# EAGLE design illuminator control boardv1-4 (EAGLE 7.6.0)
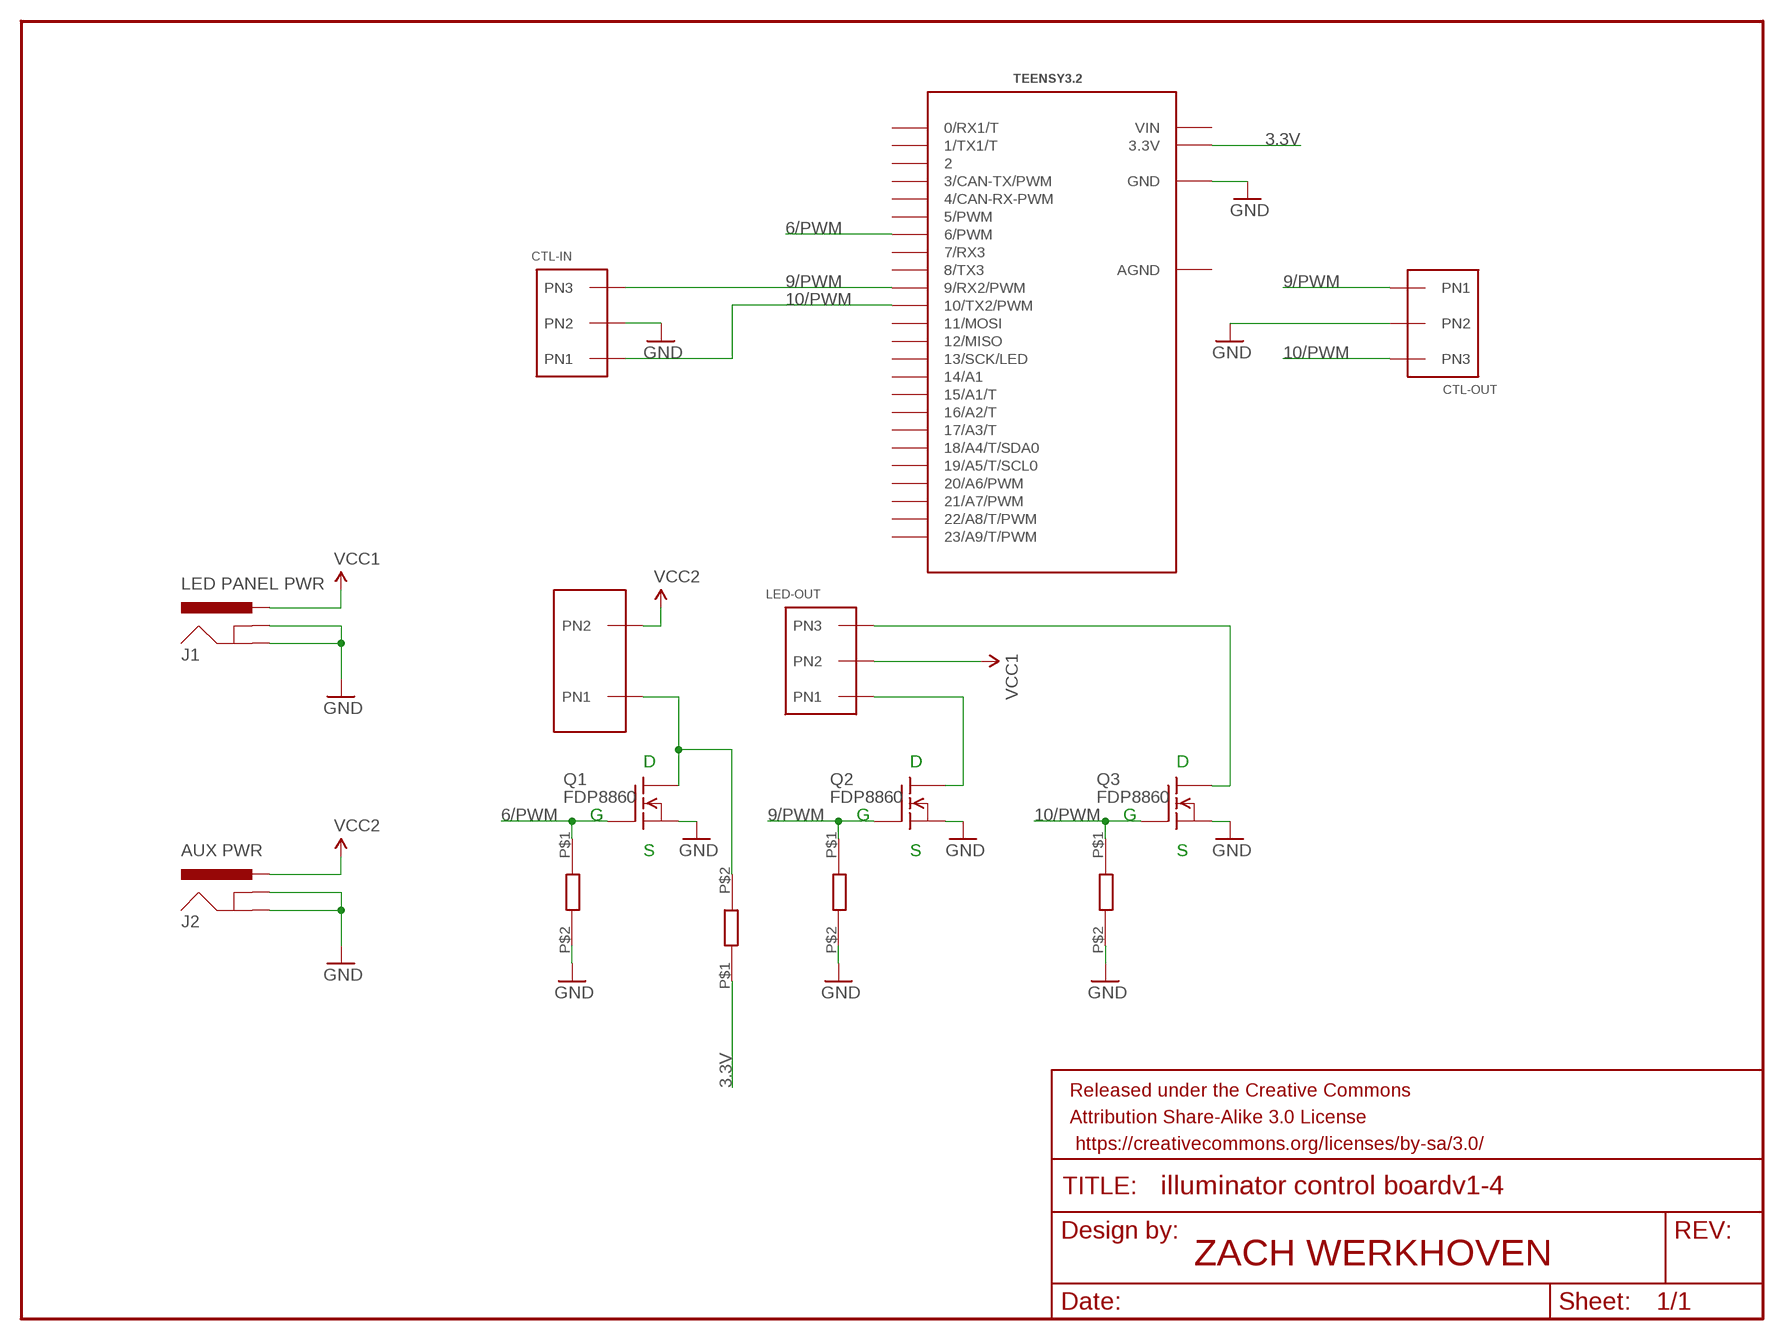
[diagram p0: schematic, sheet 1]

## Parts
AUX-OUT  AUX-OUT  MLX-2PN  [MLX-2PN]
CTL-IN  MLX-3PN  [MLX-3PN]
CTL-OUT  MLX-3PN  [MLX-3PN]
FRAME1  FRAME-LETTER  [CREATIVE_COMMONS]
J1  LED PANEL PWR  POWER_JACKPTH_BREAD  [POWER_JACK_PTH_BREAD]
J2  AUX PWR  POWER_JACKPTH_BREAD  [POWER_JACK_PTH_BREAD]
LED-OUT  MLX-3PN  [MLX-3PN]
Q1  FDP8860  BUZ10  [TO220]
Q2  FDP8860  BUZ10  [TO220]
Q3  FDP8860  BUZ10  [TO220]
TEENSY3.2  TEENSY_3.1_DIL  [TEENSY3-DIL]
U$1  SMD-1206  [SMD-1206]
U$2  SMD-1206  [SMD-1206]
U$3  SMD-1206  [SMD-1206]
U$5  SMD-1206  [SMD-1206]

## Nets
3.3V: TEENSY3.2.3.3V U$5.P$1
6/PWM: Q1.1(G) TEENSY3.2.6(6/PWM) U$1.P$1
9/PWM: CTL-IN.PN3 CTL-OUT.PN1 Q2.1(G) TEENSY3.2.9(9/RX2/PWM) U$2.P$1
10/PWM: CTL-IN.PN1 CTL-OUT.PN3 Q3.1(G) TEENSY3.2.10(10/TX2/PWM) U$3.P$1
GND: CTL-IN.PN2 CTL-OUT.PN2 J1.GND J1.GNDBREAK J2.GND J2.GNDBREAK Q1.3(S) Q2.3(S) Q3.3(S) TEENSY3.2.GND U$1.P$2 U$2.P$2 U$3.P$2
N$1: LED-OUT.PN3 Q3.2(D)
N$2: LED-OUT.PN1 Q2.2(D)
N$3: AUX-OUT.PD1(PN1) Q1.2(D) U$5.P$2
VCC: AUX-OUT.PD2(PN2) J1.PWR J2.PWR LED-OUT.PN2 ; supply symbol labelled VCC1, VCC2
Unconnected: TEENSY3.2.0(0/RX1/T) TEENSY3.2.1(1/TX1/T) TEENSY3.2.2 TEENSY3.2.3(3/CAN-TX/PWM) TEENSY3.2.4(4/CAN-RX-PWM) TEENSY3.2.5(5/PWM) TEENSY3.2.7(7/RX3) TEENSY3.2.8(8/TX3) TEENSY3.2.11(11/MOSI) TEENSY3.2.12(12/MISO) TEENSY3.2.13(13/SCK/LED) TEENSY3.2.14/A0(14/A1) TEENSY3.2.15/A1(15/A1/T) TEENSY3.2.16/A2(16/A2/T) TEENSY3.2.17/A3(17/A3/T) TEENSY3.2.18/A4(18/A4/T/SDA0) TEENSY3.2.19/A5(19/A5/T/SCL0) TEENSY3.2.20/A6(20/A6/PWM) TEENSY3.2.21/A7(21/A7/PWM) TEENSY3.2.22/A8(22/A8/T/PWM) TEENSY3.2.23/A9(23/A9/T/PWM)

## Notes on the sheet
- D | D | D
- G | G | G
- S | S | S
- ZACH WERKHOVEN

## Power pins joined to a net without a drawn wire
AGND: TEENSY3.2.AGND
VIN: TEENSY3.2.VIN

## Library data of the parts
AUX-OUT = Zach-Custom:MLX-2PN
CTL-IN CTL-OUT LED-OUT = Zach-Custom:MLX-3PN: MOLEX 3-PIN RIGHT ANGLE THROUGH HOLE CONNECTOR (MALE) - Digikey PN WM2785-ND Mates with Digikey PN WM2001-ND
FRAME1 = SparkFun-Retired:FRAME-LETTER: Schematic Frame Standard 8.5x11 US Letter frame
J1 J2 = SparkFun-Connectors:POWER_JACK: Power Jack This is the standard 5.5mm barrel jack for power. The PTH is the most common, proven, reliable, footprint. The Slot footprint only works if the mill layer is transmitted to the PCB fab house so be warned. Mating wall wart : TOL-00298 (and others); PROD_ID: PRT-10811
Q1 = Zach-Custom:BUZ10: N-Channel Enhancement MOSFET 50V; 20A; 0,080Ohm
Q2 Q3 = transistor-fet:BUZ10: N-Channel Enhancement MOSFET 50V; 20A; 0,080Ohm
TEENSY3.2 = Teensy_3_and_LC_Series_Boards_v1.1:TEENSY_3.1_DIL: Teensy 3.1 or 3.2 in a DIL Layout.
U$1-U$3 U$5 = Zach-Custom:SMD-1206

## Board
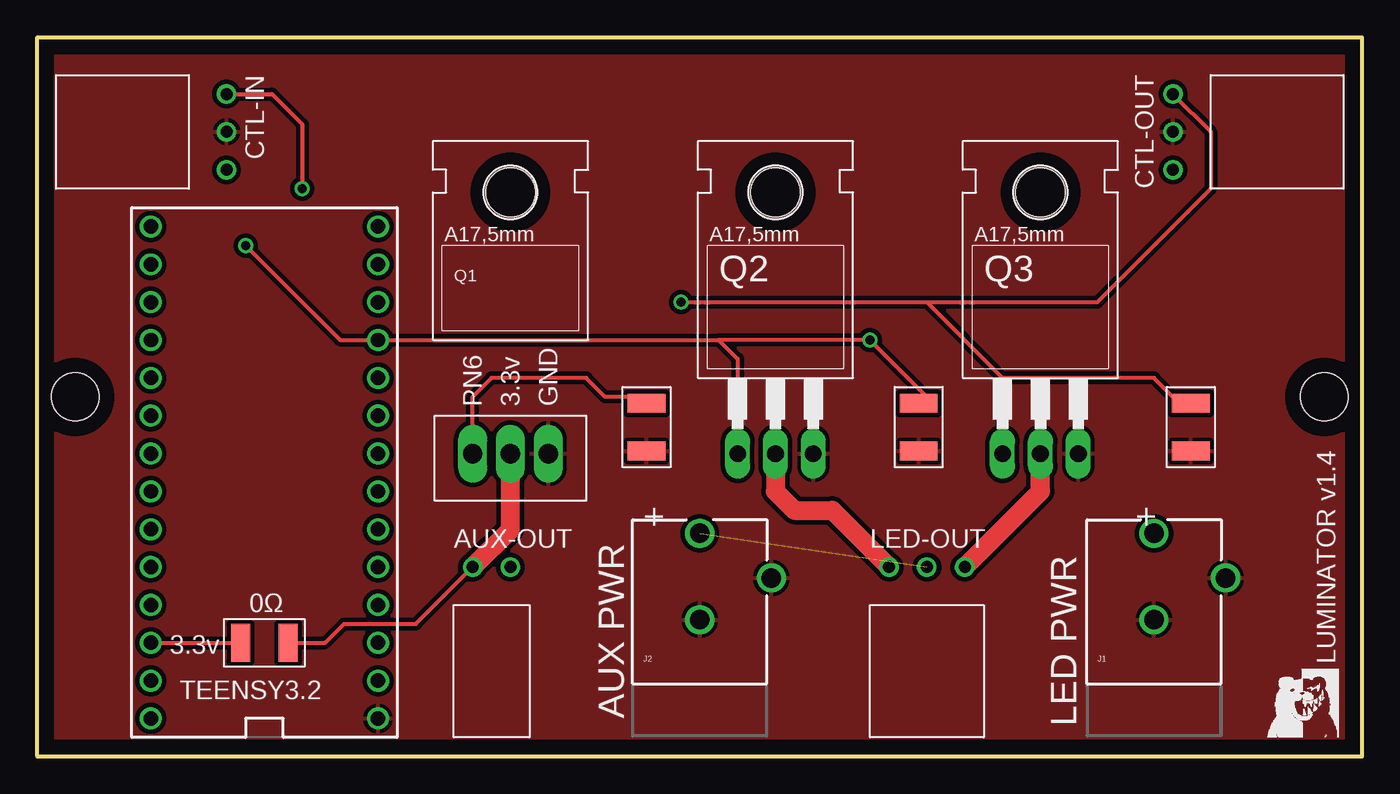
[diagram p1: board, top side]
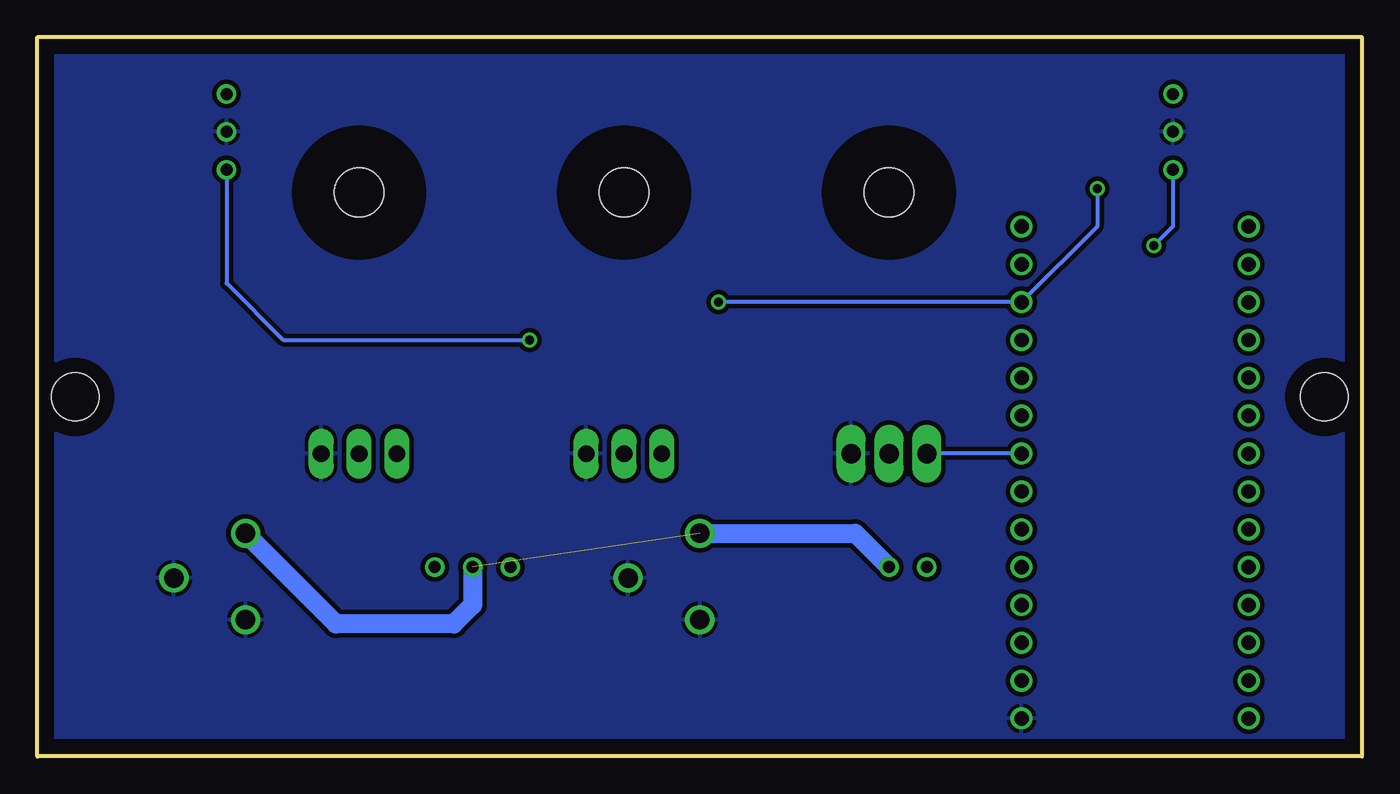
[diagram p2: board, bottom side, seen from below]

Size 88.9 x 48.26 mm. Coordinates in mm from the lower left corner, seen from the top.
Outline: 0,0 0,48.26 88.9,48.26 88.9,0 0,0
Copper layers (1*16): Top 0.035mm / dielectric 1.5mm / Bottom 0.035mm
Design rules "default": minimum track width 10mil, minimum drill 24mil, track to track 8mil, track to pad 8mil, pad to pad 8mil, via to via 8mil, smd to smd 8mil, copper to edge 40mil, drill to drill 8mil, minimum pad ring 10mil, minimum via ring 8mil, stop-mask expansion 4mil, vias tented up to drill 0mil, thermal gap 10mil
Holes 3.2 mm at 2.54,24.13 86.36,24.13

### Footprints (pad centres in the part's own frame; a part is rotated, then mirrored left to right if it is on the bottom)
MLX-2PN = drill 0.8 pad 1.27: PD1 -1.27,6.35; PD2 1.27,6.35
MLX-3PN = drill 0.8 pad 1.27: PN1 -2.54,6.35; PN2 0,6.35; PN3 2.54,6.35
POWER_JACK_PTH_BREAD = drill 1.3: GND 0,7.9; GNDBREAK 4.8,10.7; PWR 0,13.7
TO220 = drill 1.3 pad 1.778 long: 1 -2.54,-6.35; 2 0,-6.35; 3 2.54,-6.35 | hole 3.302: 0,11.176
TO220' = drill 1.118 long: 1 -2.54,-6.35; 2 0,-6.35; 3 2.54,-6.35 | hole 3.302: 0,11.176
TEENSY3-DIL = drill 0.965: 0 -7.62,13.97; 1 -7.62,11.43; 2 -7.62,8.89; 3 -7.62,6.35; 3.3V 7.62,11.43; 4 -7.62,3.81; 5 -7.62,1.27; 6 -7.62,-1.27; 7 -7.62,-3.81; 8 -7.62,-6.35; 9 -7.62,-8.89; 10 -7.62,-11.43; 11 -7.62,-13.97; 12 -7.62,-16.51; 13 7.62,-16.51; 14/A0 7.62,-13.97; 15/A1 7.62,-11.43; 16/A2 7.62,-8.89; 17/A3 7.62,-6.35; 18/A4 7.62,-3.81; 19/A5 7.62,-1.27; 20/A6 7.62,1.27; 21/A7 7.62,3.81; 22/A8 7.62,6.35; 23/A9 7.62,8.89; AGND 7.62,13.97; GND -7.62,16.51; VIN 7.62,16.51
SMD-1206 = smd 2.54 x 1.27: P$1 0,1.6; P$2 0,-1.6

### Placement (x,y rotation side)
AUX-OUT  30.48,6.35 0 top
CTL-IN  6.35,41.91 270 top
CTL-OUT  82.55,41.91 90 top
FRAME1  2.54,-8.89 0 top  (outside the outline)
J1  74.93,1.27 0 top
J2  44.45,1.27 0 top
LED-OUT  59.69,6.35 0 top
Q1  31.75,26.67 0 top
Q2  FDP8860  [TO220']  49.53,26.67 0 top
Q3  FDP8860  [TO220']  67.31,26.67 0 top
TEENSY3.2  15.24,19.05 180 top
U$1  40.88,22.1 0 top
U$2  59.14,22.1 0 top
U$3  77.4,22.1 0 top
U$5  15.24,7.62 90 top

### Tracks (layer width: path | path; a pad name or v marks a point on that pad's centre or on a via)
3.3V
  Top 0.254: TEENSY3.2.3.3V U$5.P$1
6/PWM
  Top 0.254: Q1.1 29.21,24.13 30.48,25.4 36.83,25.4 38.1,24.13 40.64,24.13 40.88,23.89 U$1.P$1
  Bottom 0.254: TEENSY3.2.6 Q1.1
9/PWM  (via drill 0.6)
  Top 0.254: 45.72,27.94 TEENSY3.2.9 20.32,27.94 v13.97,34.29 | 45.72,27.94 46.99,26.67 Q2.1 | 45.72,27.94 v55.88,27.94 59.69,24.13 59.26,23.7 U$2.P$1
  Bottom 0.254: v55.88,27.94 72.39,27.94 76.2,31.75 CTL-OUT.PN1 | v13.97,34.29 12.7,35.56 CTL-IN.PN3
10/PWM  (via drill 0.6)
  Top 0.254: 59.69,30.48 71.12,30.48 78.74,38.1 78.74,41.91 CTL-OUT.PN3 | Q3.1 64.77,25.4 | 64.77,25.4 59.69,30.48 | v43.18,30.48 59.69,30.48 | U$3.P$1 77.4,24.06 77.47,24.13 76.2,24.13 74.93,25.4 64.77,25.4 | CTL-IN.PN1 15.75,44.45 17.78,42.42 v17.78,38.1
  Bottom 0.254: v17.78,38.1 17.78,35.56 TEENSY3.2.10 v43.18,30.48
GND
  pour Bottom (isolate 0.305): 0,0 0,48.26 88.9,48.26 88.9,0
  pour Top (isolate 0.305): 0,0 0,48.26 88.9,48.26 88.9,0
N$1
  Top 1.27: LED-OUT.PN3 67.31,17.78 Q3.2
N$2
  Top 1.27: Q2.2 49.53,17.78 50.8,16.51 53.34,16.51 LED-OUT.PN1
N$3
  Top 0.254: U$5.P$2 19.3,7.62 20.57,8.89 25.4,8.89 AUX-OUT.PD1
  Top 1.27: AUX-OUT.PD1 31.75,15.24 Q1.2
VCC  (1 unrouted)
  Bottom 1.27: J2.PWR 34.02,14.97 AUX-OUT.PD2 | LED-OUT.PN2 59.69,10.16 60.96,8.89 68.85,8.89 J1.PWR

### Text on the board
tPlace: + | + | 0Ω | 3.3v | LUMINATOR v1.4 | AUX PWR | LED PWR